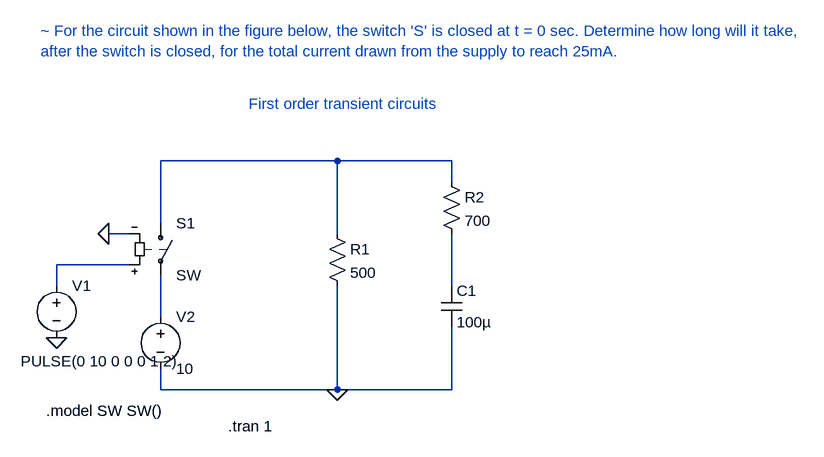
[diagram p0: schematic Lab4_ques1.asc]
Lab4_ques1.asc, the LTspice schematic file:
Version 4
SHEET 1 1060 680
WIRE 320 32 48 32
WIRE 496 32 320 32
WIRE 496 64 496 32
WIRE 48 128 48 32
WIRE 0 144 -32 144
WIRE 320 144 320 32
WIRE 0 192 -112 192
WIRE -112 224 -112 192
WIRE 496 224 496 144
WIRE 48 272 48 208
WIRE 48 384 48 352
WIRE 320 384 320 224
WIRE 320 384 48 384
WIRE 496 384 496 288
WIRE 496 384 320 384
FLAG -32 144 0
FLAG -112 304 0
FLAG 320 384 0
SYMBOL sw 48 112 R0
SYMATTR InstName S1
SYMBOL voltage -112 208 R0
WINDOW 3 -55 132 Left 2
SYMATTR InstName V1
SYMATTR Value PULSE(0 10 0 0 0 1 2)
SYMBOL Res 304 128 R0
SYMATTR InstName R1
SYMATTR Value 500
SYMBOL Res 480 48 R0
SYMATTR InstName R2
SYMATTR Value 700
SYMBOL Cap 480 224 R0
SYMATTR InstName C1
SYMATTR Value 100µ
SYMBOL Voltage 48 256 R0
SYMATTR InstName V2
SYMATTR Value 10
TEXT 184 -56 Left 2 ;First order transient circuits
TEXT -136 -168 Left 2 ;~ For the circuit shown in the figure below, the switch 'S' is closed at t = 0 sec. Determine how long will it take,\nafter the switch is closed, for the total current drawn from the supply to reach 25mA.
TEXT -128 416 Left 2 !.model SW SW()
TEXT 152 440 Left 2 !.tran 1

The netlist it stands for:
* Lab4_ques1.asc
S1 N001 N004 N002 0 SW
V1 N002 0 PULSE(0 10 0 0 0 1 2)
R1 N001 0 500
R2 N001 N003 700
C1 N003 0 100µ
V2 N004 0 10
* First order transient circuits
* ~ For the circuit shown in the figure below, the switch 'S' is closed at t = 0 sec. Determine how long will it take,
* after the switch is closed, for the total current drawn from the supply to reach 25mA.
.model SW SW()
.tran 1
.backanno
.end